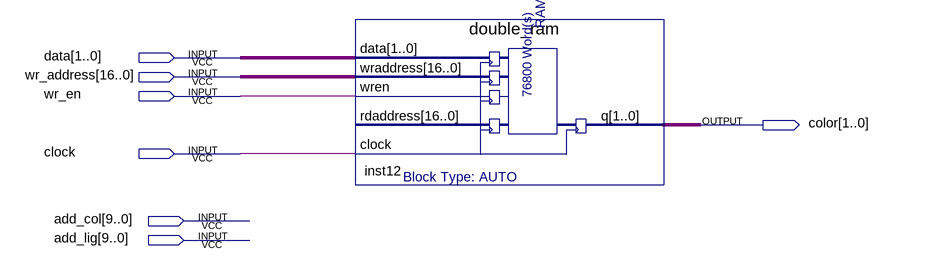
[diagram p0: schematic sheet]
// Quartus schematic ctrl_mem.bdf as structural Verilog: 1 symbols, 7 pins
module ctrl_mem (
  input  [1:0] data,
  input  [16:0] wr_address,
  input  wr_en,
  input  clock,
  input  [9:0] add_col,
  input  [9:0] add_lig,
  output [1:0] color
);

  double_ram inst12 (.data(data), .wraddress(wr_address), .wren(wr_en), .clock(clock), .q(color));  // open: rdaddress
endmodule
